# EAGLE design open2014 (EAGLE 6.1)
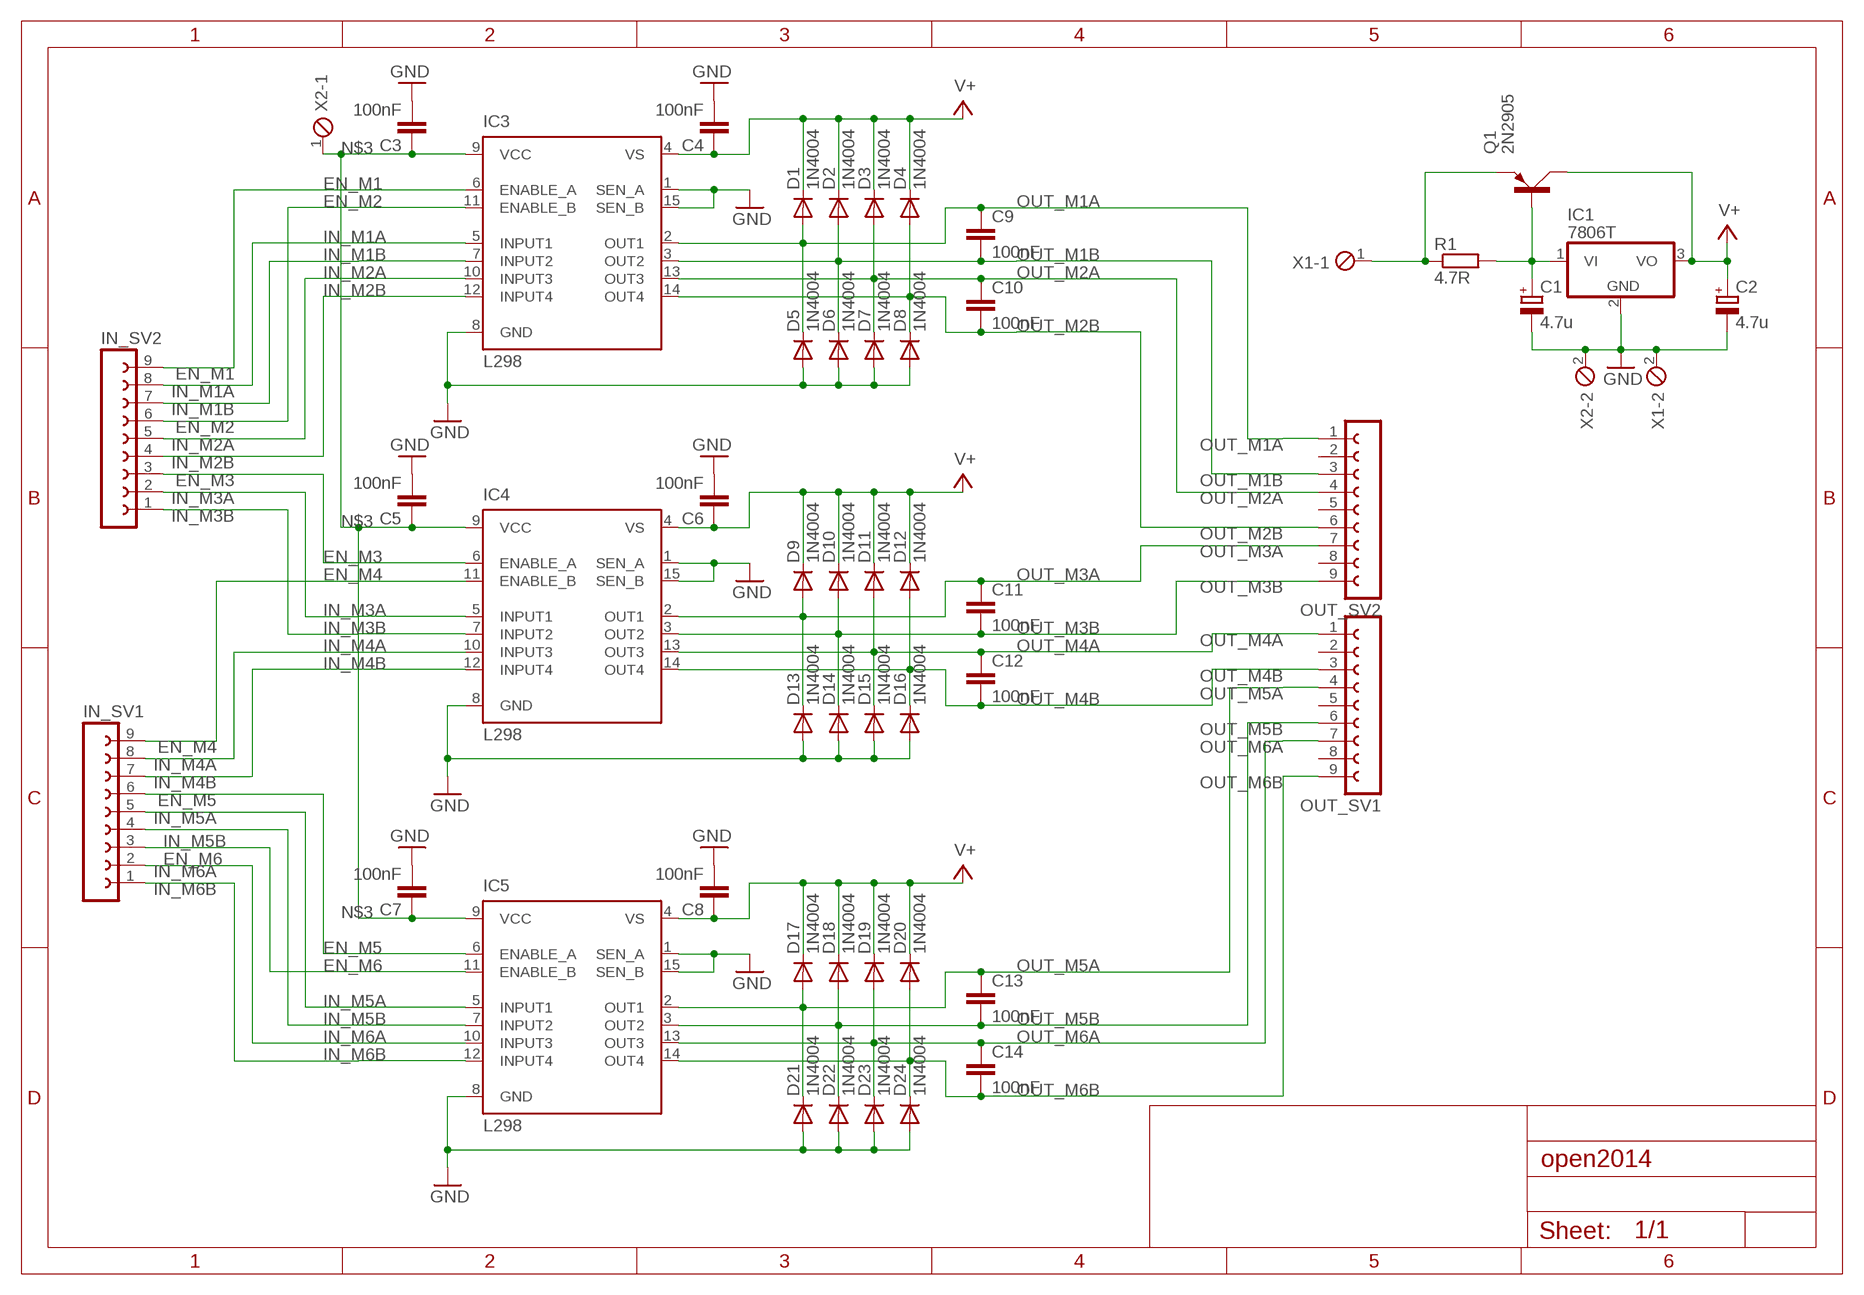
[diagram p0: schematic, sheet 1]

## Parts
C1  4.7u  CPOL-EUE2.5-6  [E2,5-6]
C2  4.7u  CPOL-EUE2.5-6  [E2,5-6]
C3  100nF  C-EU050-050X075  [C050-050X075]
C4  100nF  C-EU050-050X075  [C050-050X075]
C5  100nF  C-EU050-050X075  [C050-050X075]
C6  100nF  C-EU050-050X075  [C050-050X075]
C7  100nF  C-EU050-050X075  [C050-050X075]
C8  100nF  C-EU050-050X075  [C050-050X075]
C9  100nF  C-EU050-050X075  [C050-050X075]
C10  100nF  C-EU050-050X075  [C050-050X075]
C11  100nF  C-EU050-050X075  [C050-050X075]
C12  100nF  C-EU050-050X075  [C050-050X075]
C13  100nF  C-EU050-050X075  [C050-050X075]
C14  100nF  C-EU050-050X075  [C050-050X075]
D1  1N4004  [DO41-10]
D2  1N4004  [DO41-10]
D3  1N4004  [DO41-10]
D4  1N4004  [DO41-10]
D5  1N4004  [DO41-10]
D6  1N4004  [DO41-10]
D7  1N4004  [DO41-10]
D8  1N4004  [DO41-10]
D9  1N4004  [DO41-10]
D10  1N4004  [DO41-10]
D11  1N4004  [DO41-10]
D12  1N4004  [DO41-10]
D13  1N4004  [DO41-10]
D14  1N4004  [DO41-10]
D15  1N4004  [DO41-10]
D16  1N4004  [DO41-10]
D17  1N4004  [DO41-10]
D18  1N4004  [DO41-10]
D19  1N4004  [DO41-10]
D20  1N4004  [DO41-10]
D21  1N4004  [DO41-10]
D22  1N4004  [DO41-10]
D23  1N4004  [DO41-10]
D24  1N4004  [DO41-10]
IC1  7806T  [TO220H]
IC3  L298  [MULTIWATT-15]
IC4  L298  [MULTIWATT-15]
IC5  L298  [MULTIWATT-15]
IN_SV1  FE09-1  [FE09]
IN_SV2  FE09-1  [FE09]
OUT_SV1  FE09-1  [FE09]
OUT_SV2  FE09-1  [FE09]
Q1  2N2905  [TO39]
R1  4.7R  R-EU_0411/15  [0411/15]
X1  MPT2  [2POL254]
X2  MPT2  [2POL254]

## Nets
EN_M1: IC3.6(ENABLE_A) IN_SV2.9
EN_M2: IC3.11(ENABLE_B) IN_SV2.6
EN_M3: IC4.6(ENABLE_A) IN_SV2.3
EN_M4: IC4.11(ENABLE_B) IN_SV1.9
EN_M5: IC5.6(ENABLE_A) IN_SV1.6
EN_M6: IC5.11(ENABLE_B) IN_SV1.3
GND: C1.- C2.- C3.2 C4.2 C5.2 C6.2 C7.2 C8.2 D5.A D6.A D7.A D8.A D13.A D14.A D15.A D16.A D21.A D22.A D23.A D24.A IC1.2(GND) IC3.1(SEN_A) IC3.8(GND) IC3.15(SEN_B) IC4.1(SEN_A) IC4.8(GND) IC4.15(SEN_B) IC5.1(SEN_A) IC5.8(GND) IC5.15(SEN_B) X1.2 X2.2
IN_M1A: IC3.5(INPUT1) IN_SV2.8
IN_M1B: IC3.7(INPUT2) IN_SV2.7
IN_M2A: IC3.10(INPUT3) IN_SV2.5
IN_M2B: IC3.12(INPUT4) IN_SV2.4
IN_M3A: IC4.5(INPUT1) IN_SV2.2
IN_M3B: IC4.7(INPUT2) IN_SV2.1
IN_M4A: IC4.10(INPUT3) IN_SV1.8
IN_M4B: IC4.12(INPUT4) IN_SV1.7
IN_M5A: IC5.5(INPUT1) IN_SV1.5
IN_M5B: IC5.7(INPUT2) IN_SV1.4
IN_M6A: IC5.10(INPUT3) IN_SV1.2
IN_M6B: IC5.12(INPUT4) IN_SV1.1
N$1: Q1.1(E) R1.1 X1.1
N$2: C1.+ IC1.1(VI) Q1.2(B) R1.2
N$3: C3.1 C5.1 C7.1 IC3.9(VCC) IC4.9(VCC) IC5.9(VCC) X2.1
OUT_M1A: C9.1 D1.A D5.C IC3.2(OUT1) OUT_SV2.1
OUT_M1B: C9.2 D2.A D6.C IC3.3(OUT2) OUT_SV2.3
OUT_M2A: C10.1 D3.A D7.C IC3.13(OUT3) OUT_SV2.4
OUT_M2B: C10.2 D4.A D8.C IC3.14(OUT4) OUT_SV2.6
OUT_M3A: C11.1 D9.A D13.C IC4.2(OUT1) OUT_SV2.7
OUT_M3B: C11.2 D10.A D14.C IC4.3(OUT2) OUT_SV2.9
OUT_M4A: C12.1 D11.A D15.C IC4.13(OUT3) OUT_SV1.1
OUT_M4B: C12.2 D12.A D16.C IC4.14(OUT4) OUT_SV1.3
OUT_M5A: C13.1 D17.A D21.C IC5.2(OUT1) OUT_SV1.4
OUT_M5B: C13.2 D18.A D22.C IC5.3(OUT2) OUT_SV1.6
OUT_M6A: C14.1 D19.A D23.C IC5.13(OUT3) OUT_SV1.7
OUT_M6B: C14.2 D20.A D24.C IC5.14(OUT4) OUT_SV1.9
V+: C2.+ C4.1 C6.1 C8.1 D1.C D2.C D3.C D4.C D9.C D10.C D11.C D12.C D17.C D18.C D19.C D20.C IC1.3(VO) IC3.4(VS) IC4.4(VS) IC5.4(VS) Q1.3(C)
Unconnected: OUT_SV1.2 OUT_SV1.5 OUT_SV1.8 OUT_SV2.2 OUT_SV2.5 OUT_SV2.8

## Library data of the parts
C1 C2 = resistor:CPOL-EU: POLARIZED CAPACITOR, European symbol
C3-C14 = resistor:C-EU: CAPACITOR, European symbol
D1-D24 = diode:1N4004: DIODE general purpose rectifier, 1 A
IC1 = linear:78*: Positive VOLTAGE REGULATOR Source: http://cache.national.com/ds/LM/LM78L05.pdf http://www.fairchildsemi.com/ds/LM/LM7805.pdf
IC3-IC5 = st-microelectronics:L298: DUAL FULL-BRIDGE DRIVER; MPN: L298N; OC_FARNELL: 1589425; OC_NEWARK: 32M1527
IN_SV1 IN_SV2 OUT_SV1 OUT_SV2 = con-lsta:FE09-1: FEMALE HEADER; OC_FARNELL: unknown; OC_NEWARK: unknown
Q1 = transistor-small-signal:2N2905: PNP bipolar
R1 = resistor:R-EU_: RESISTOR, European symbol
X1 X2 = con-phoenix-254:MPT2: PHOENIX CONNECTOR; OC_FARNELL: unknown; OC_NEWARK: unknown

## Board
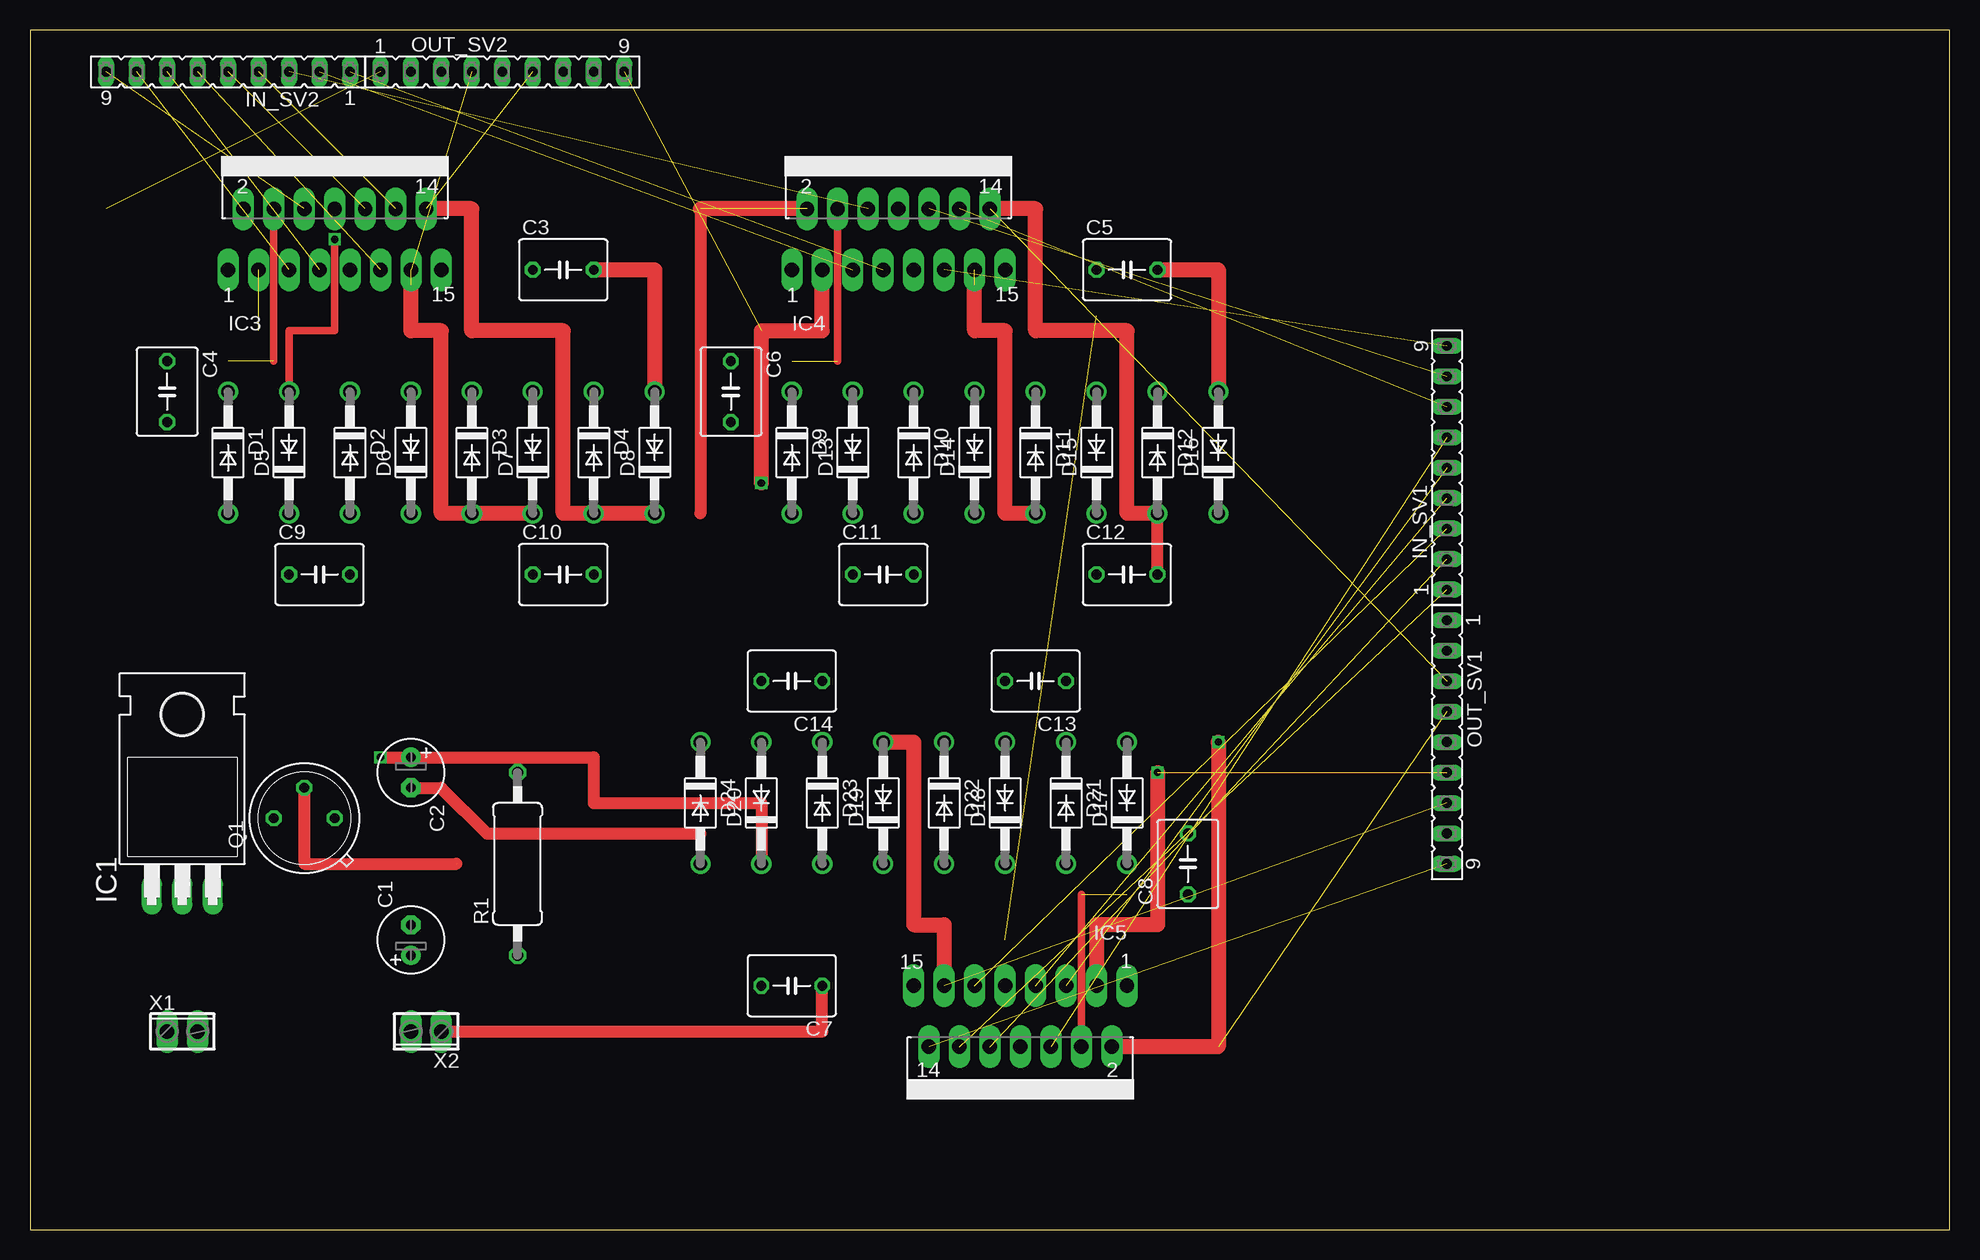
[diagram p1: board, top side]
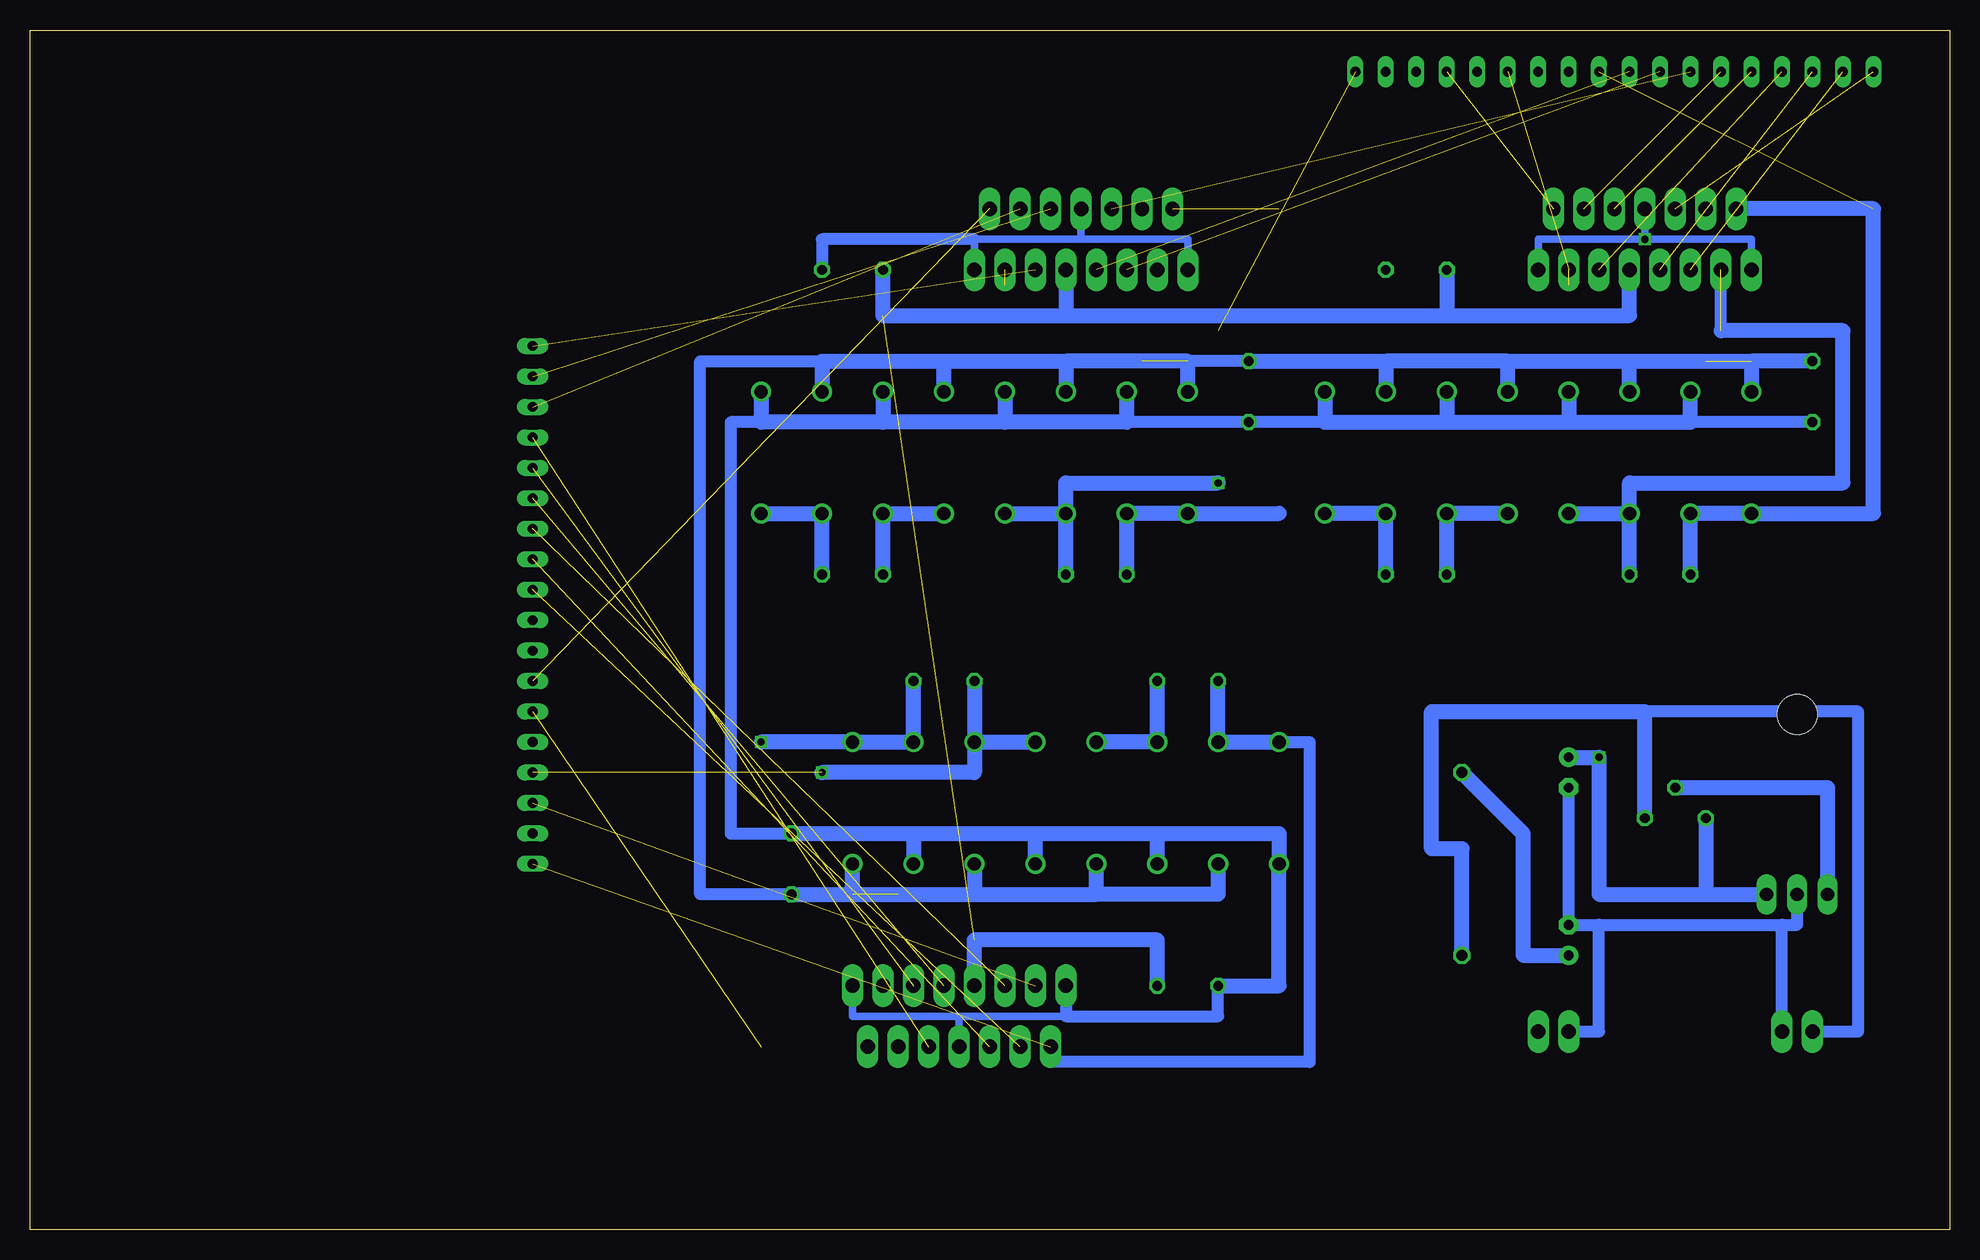
[diagram p2: board, bottom side, seen from below]

Size 160 x 100 mm. Coordinates in mm from the lower left corner, seen from the top.
Outline: 0,0 160,0 160,100 0,100 0,0
Copper layers (1*16): Top 0.035mm / dielectric 1.5mm / Bottom 0.035mm
Design rules: minimum track width 30mil, minimum drill 24mil, track to track 8mil, track to pad 8mil, pad to pad 8mil, via to via 8mil, smd to smd 8mil, copper to edge 40mil, drill to drill 8mil, minimum pad ring 10mil, minimum via ring 8mil, stop-mask expansion 4mil, vias tented up to drill 0mil, thermal gap 10mil

### Footprints (pad centres in the part's own frame; a part is rotated, then mirrored left to right if it is on the bottom)
E2,5-6 = drill 0.813 pad 1.6: + -1.27,0 | drill 0.813 pad 1.6 octagon: - 1.27,0
C050-050X075 = drill 0.813 octagon: 1 -2.54,0; 2 2.54,0
DO41-10 = drill 1.118: A 5.08,0; C -5.08,0
TO220H = drill 1.118 long: 1 -2.54,-10.16; 2 0,-10.16; 3 2.54,-10.16 | hole 3.302: 0,4.826
MULTIWATT-15 = drill 1.2 long: 1 -8.89,-7.62; 2 -7.62,-2.54; 3 -6.35,-7.62; 4 -5.08,-2.54; 5 -3.81,-7.62; 6 -2.54,-2.54; 7 -1.27,-7.62; 8 0,-2.54; 9 1.27,-7.62; 10 2.54,-2.54; 11 3.81,-7.62; 12 5.08,-2.54; 13 6.35,-7.62; 14 7.62,-2.54; 15 8.89,-7.62
FE09 = drill 0.813 long: 1 -10.16,0; 2 -7.62,0; 3 -5.08,0; 4 -2.54,0; 5 0,0; 6 2.54,0; 7 5.08,0; 8 7.62,0; 9 10.16,0
TO39 = drill 0.813 octagon: 1 0,-2.54; 2 2.54,0; 3 0,2.54
0411/15 = drill 0.914 octagon: 1 -7.62,0; 2 7.62,0
2POL254 = drill 1.2 long: 1 -1.27,0; 2 1.27,0

### Placement (x,y rotation side)
C1  31.75,24.13 90 top
C2  31.75,38.1 270 top
C3  44.45,80.01 0 top
C4  11.43,69.85 270 top
C5  91.44,80.01 0 top
C6  58.42,69.85 270 top
C7  63.5,20.32 180 top
C8  96.52,30.48 90 top
C9  24.13,54.61 0 top
C10  44.45,54.61 0 top
C11  71.12,54.61 0 top
C12  91.44,54.61 0 top
C13  83.82,45.72 180 top
C14  63.5,45.72 180 top
D1  16.51,64.77 270 top
D2  26.67,64.77 270 top
D3  36.83,64.77 270 top
D4  46.99,64.77 270 top
D5  21.59,64.77 90 top
D6  31.75,64.77 90 top
D7  41.91,64.77 90 top
D8  52.07,64.77 90 top
D9  63.5,64.77 270 top
D10  73.66,64.77 270 top
D11  83.82,64.77 270 top
D12  93.98,64.77 270 top
D13  68.58,64.77 90 top
D14  78.74,64.77 90 top
D15  88.9,64.77 90 top
D16  99.06,64.77 90 top
D17  91.44,35.56 90 top
D18  81.28,35.56 90 top
D19  71.12,35.56 90 top
D20  60.96,35.56 90 top
D21  86.36,35.56 270 top
D22  76.2,35.56 270 top
D23  66.04,35.56 270 top
D24  55.88,35.56 270 top
IC1  12.7,38.1 0 top
IC3  25.4,87.63 0 top
IC4  72.39,87.63 0 top
IC5  82.55,12.7 180 top
IN_SV1  118.11,63.5 90 top
IN_SV2  16.51,96.52 180 top
OUT_SV1  118.11,40.64 270 top
OUT_SV2  39.37,96.52 0 top
Q1  22.86,34.29 90 top
R1  40.64,30.48 90 top
X1  12.7,16.51 0 top
X2  33.02,16.51 180 top

### Tracks (layer width: path | path; a pad name or v marks a point on that pad's centre or on a via)
EN_M1  (1 unrouted)
EN_M2  (1 unrouted)
EN_M3  (1 unrouted)
EN_M4  (1 unrouted)
EN_M5  (1 unrouted)
EN_M6  (1 unrouted)
GND  (via drill 0.6)  (1 unrouted)
  Top 0.61: v25.4,82.55 25.4,74.93 21.59,74.93 D5.A
  Top 1.016: C2.- 34.29,36.83 38.1,33.02 55.88,33.02
  Top 1.27: C3.2 52.07,80.01 D8.A | C5.2 99.06,80.01 D16.A
  Bottom 0.61: IC3.1 16.51,82.55 v25.4,82.55 | IC3.8 v25.4,82.55 | IC4.8 72.39,82.55 | 72.39,82.55 63.5,82.55 IC4.1 | 72.39,82.55 81.28,82.55 IC4.15 | IC5.1 91.44,17.78 82.55,17.78 | 82.55,17.78 IC5.8 | 73.66,17.78 82.55,17.78 | IC3.15 34.29,82.55 v25.4,82.55
  Bottom 1.016: C2.- C1.- 29.21,25.4 | 68.58,67.31 C6.2 52.07,67.31 | 81.28,82.55 93.98,82.55 C5.2 | IC5.15 73.66,17.78 60.96,17.78 C7.2 | 29.21,25.4 13.97,25.4 | 13.97,25.4 12.7,25.4 IC1.2 | 99.06,67.31 101.6,67.31 101.6,33.02 C8.2 | C4.2 21.59,67.31 | X2.2 29.21,16.51 29.21,25.4 | X1.2 13.97,25.4
  Bottom 1.27: D8.A 52.07,67.31 41.91,67.31 | D7.A 41.91,67.31 | 41.91,67.31 31.75,67.31 | D6.A 31.75,67.31 | 31.75,67.31 21.59,67.31 D5.A | 78.74,67.31 68.58,67.31 D13.A | D14.A 78.74,67.31 | 78.74,67.31 88.9,67.31 | D15.A 88.9,67.31 | 88.9,67.31 99.06,67.31 D16.A | 86.36,33.02 76.2,33.02 | 76.2,33.02 66.04,33.02 | 66.04,33.02 55.88,33.02 D24.A 55.88,20.32 C7.2 | D23.A 66.04,33.02 | D22.A 76.2,33.02 | C8.2 86.36,33.02 | 86.36,33.02 D21.A
IN_M1A  (1 unrouted)
IN_M1B  (1 unrouted)
IN_M2A  (1 unrouted)
IN_M2B  (1 unrouted)
IN_M3A  (1 unrouted)
IN_M3B  (1 unrouted)
IN_M4A  (1 unrouted)
IN_M4B  (1 unrouted)
IN_M5A  (1 unrouted)
IN_M5B  (1 unrouted)
IN_M6A  (1 unrouted)
IN_M6B  (1 unrouted)
N$1
  Bottom 1.016: X1.1 7.62,16.51 7.62,43.18 25.4,43.18
  Bottom 1.27: R1.1 40.64,31.75 43.18,31.75 43.18,43.18 25.4,43.18 Q1.1
N$2  (1 unrouted)
  Top 1.016: Q1.2 22.86,30.48 35.56,30.48
  Bottom 1.27: R1.2 35.56,33.02 35.56,22.86 C1.+ | IC1.1 10.16,36.83 Q1.2
N$3  (1 unrouted)
  Top 1.016: X2.1 66.04,16.51 C7.1
  Bottom 1.27: C3.1 41.91,76.2 | 41.91,76.2 26.67,76.2 IC3.9 | 73.66,76.2 88.9,76.2 C5.1 | IC4.9 73.66,76.2 | 73.66,76.2 41.91,76.2 | C7.1 66.04,24.13 81.28,24.13 IC5.9
OUT_M1A  (1 unrouted)
  Bottom 1.27: C9.1 D5.C D1.A 6.35,59.69 6.35,85.09 IC3.2
OUT_M1B  (2 unrouted)
  Bottom 1.016: 19.05,74.93 IC3.3
  Bottom 1.27: C9.2 D2.A | D2.A 26.67,62.23 8.89,62.23 8.89,74.93 19.05,74.93 | D6.C D2.A
OUT_M2A  (2 unrouted)
  Top 1.27: D7.C 34.29,59.69 34.29,74.93 31.75,74.93 31.75,78.74
  Bottom 1.27: D3.A D7.C C10.1
OUT_M2B  (1 unrouted)
  Top 1.27: D8.C 44.45,59.69 44.45,74.93 36.83,74.93 36.83,85.09 IC3.14
  Bottom 1.27: D8.C D4.A C10.2
OUT_M3A  (3 unrouted)
  Top 1.016: 55.88,85.09 55.88,59.69
  Top 1.27: IC4.2 55.88,85.09
  Bottom 1.27: C11.1 D13.C D9.A 55.88,59.69
OUT_M3B  (via drill 0.6)  (1 unrouted)
  Top 1.27: v60.96,62.23 60.96,74.93 66.04,74.93 IC4.3
  Bottom 1.27: C11.2 D10.A | v60.96,62.23 73.66,62.23 D10.A | D14.C D10.A
OUT_M4A  (1 unrouted)
  Top 1.016: 78.74,74.93 IC4.13
  Top 1.27: D11.A 81.28,59.69 81.28,74.93 78.74,74.93 78.74,78.74
  Bottom 1.27: D11.A D15.C C12.1
OUT_M4B  (1 unrouted)
  Top 1.016: C12.2 D12.A
  Top 1.27: D12.A 91.44,59.69 91.44,74.93 83.82,74.93 83.82,85.09 IC4.14
  Bottom 1.27: C12.2 D12.A D16.C
OUT_M5A  (via drill 0.6)  (1 unrouted)
  Top 1.27: v99.06,40.64 99.06,15.24 IC5.2
  Bottom 1.27: C13.1 D21.C D17.A v99.06,40.64
OUT_M5B  (via drill 0.6)  (1 unrouted)
  Top 1.27: v93.98,38.1 93.98,25.4 88.9,25.4 IC5.3
  Bottom 1.27: D18.A D22.C | C13.2 D18.A | D18.A 81.28,38.1 v93.98,38.1
OUT_M6A  (1 unrouted)
  Top 1.27: D19.A 73.66,40.64 73.66,25.4 76.2,25.4 IC5.13
  Bottom 1.27: D19.A D23.C C14.1
OUT_M6B  (1 unrouted)
  Bottom 1.016: D20.A 53.34,40.64 53.34,13.97 74.93,13.97 IC5.14
  Bottom 1.27: D24.C D20.A C14.2
V+  (via drill 0.6)  (3 unrouted)
  Top 0.61: IC3.4 20.32,72.39 | IC4.4 67.31,72.39 | IC5.4 87.63,27.94
  Top 1.016: v29.21,39.37 46.99,39.37 46.99,35.56 60.96,35.56 D20.C
  Bottom 1.016: C6.1 63.5,72.39 | C8.1 104.14,27.94 104.14,72.39 93.98,72.39
  Bottom 1.27: C2.+ v29.21,39.37 29.21,27.94 20.32,27.94 | Q1.3 20.32,27.94 | 20.32,27.94 IC1.3 | 36.83,72.39 46.99,72.39 | D3.C 36.83,72.39 | 36.83,72.39 26.67,72.39 | D2.C 26.67,72.39 | 26.67,72.39 16.51,72.39 | D9.C 63.5,72.39 73.66,72.39 | 73.66,72.39 D10.C | 83.82,72.39 93.98,72.39 D12.C | D11.C 83.82,72.39 | 83.82,72.39 73.66,72.39 | 91.44,27.94 81.28,27.94 | D18.C 81.28,27.94 | 81.28,27.94 71.12,27.94 | 71.12,27.94 D19.C | D20.C 60.96,27.94 71.12,27.94 | C4.1 16.51,72.39 | 16.51,72.39 D1.C | C6.1 46.99,72.39 | 46.99,72.39 D4.C | C8.1 91.44,27.94 | 91.44,27.94 D17.C